# Altium schematic sheet MCU.SchDoc
size A4; SheetNumber: 2; SheetTotal: 7
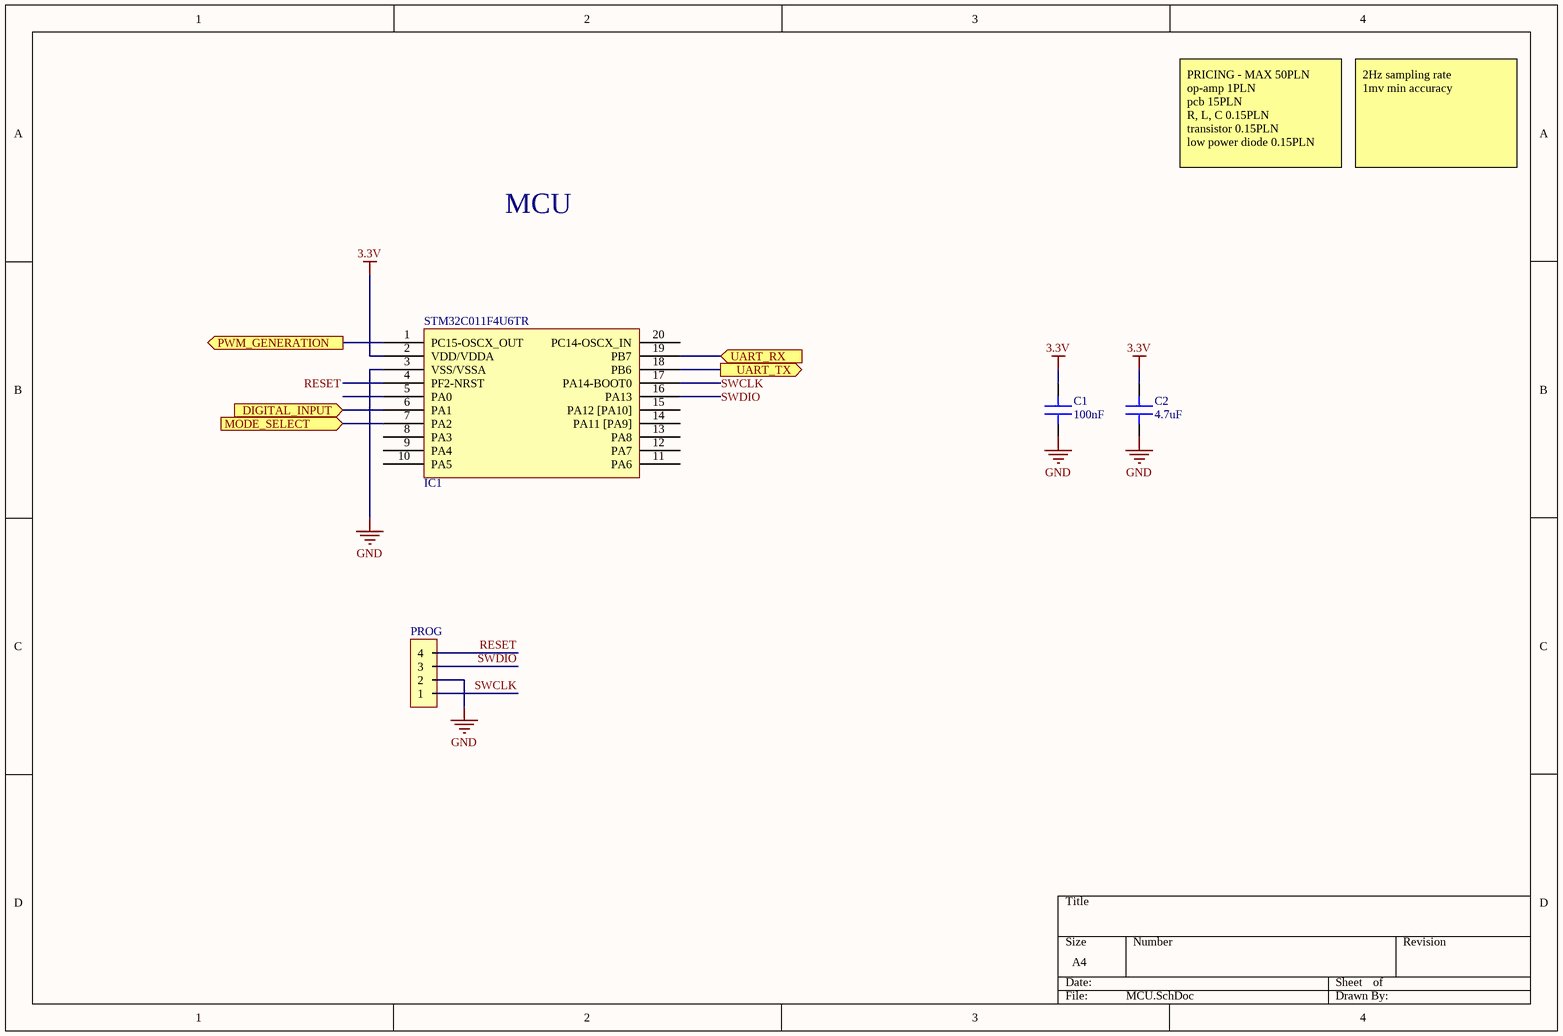
[diagram p0: MCU.SchDoc]

## Parts
C1  100nF  [C 0603]
C2  4.7uF  [C 0603]
IC1  STM32C011F4U6TR  [UFQFPN20 - byMe]  (value not drawn)
PROG  4 PIN  [BM04B-SRSS-TB]  (value not drawn)

## Ports
DIGITAL_INPUT (in), MODE_SELECT (in), PWM_GENERATION (out), UART_RX (in), UART_TX (out)

## Nets
3.3V: C1.1 C2.1 IC1.2(VDD/VDDA)
GND: C1.2 C2.2 IC1.3(VSS/VSSA) PROG.2
DIGITAL_INPUT: IC1.6(PA1) ; port DIGITAL_INPUT
MODE_SELECT: IC1.7(PA2) ; port MODE_SELECT
PWM_GENERATION: IC1.1(PC15-OSCX_OUT) ; port PWM_GENERATION
RESET: IC1.4(PF2-NRST) PROG.4
SWCLK: IC1.17(PA14-BOOT0) PROG.1
SWDIO: IC1.16(PA13) PROG.3
UART_RX: IC1.19(PB7) ; port UART_RX
UART_TX: IC1.18(PB6) ; port UART_TX

Not connected (* = marked no-connect by the designer): IC1 5(PA0) 8(PA3) 9(PA4) 10(PA5) 11(PA6) 12(PA7) 13(PA8) 14(PA11_[PA9]) 15(PA12_[PA10]) 20(PC14-OSCX_IN)

## Notes on the sheet
- PRICING - MAX 50PLN
  op-amp 1PLN
  pcb 15PLN
  R, L, C 0.15PLN
  transistor 0.15PLN
  low power diode 0.15PLN
- 2Hz sampling rate
  1mv min accuracy
- MCU

## Library data of the parts
C1 C2 = Capacitor: MLCC Capacitor
IC1 = STM32C011F4U6TR: ComponentLink1Description: Datasheet; ComponentLink1URL: https://www.alldatasheet.com/datasheet-pdf/download/1583958/STMICROELECTRONICS/STM32C011F4U6TR.html